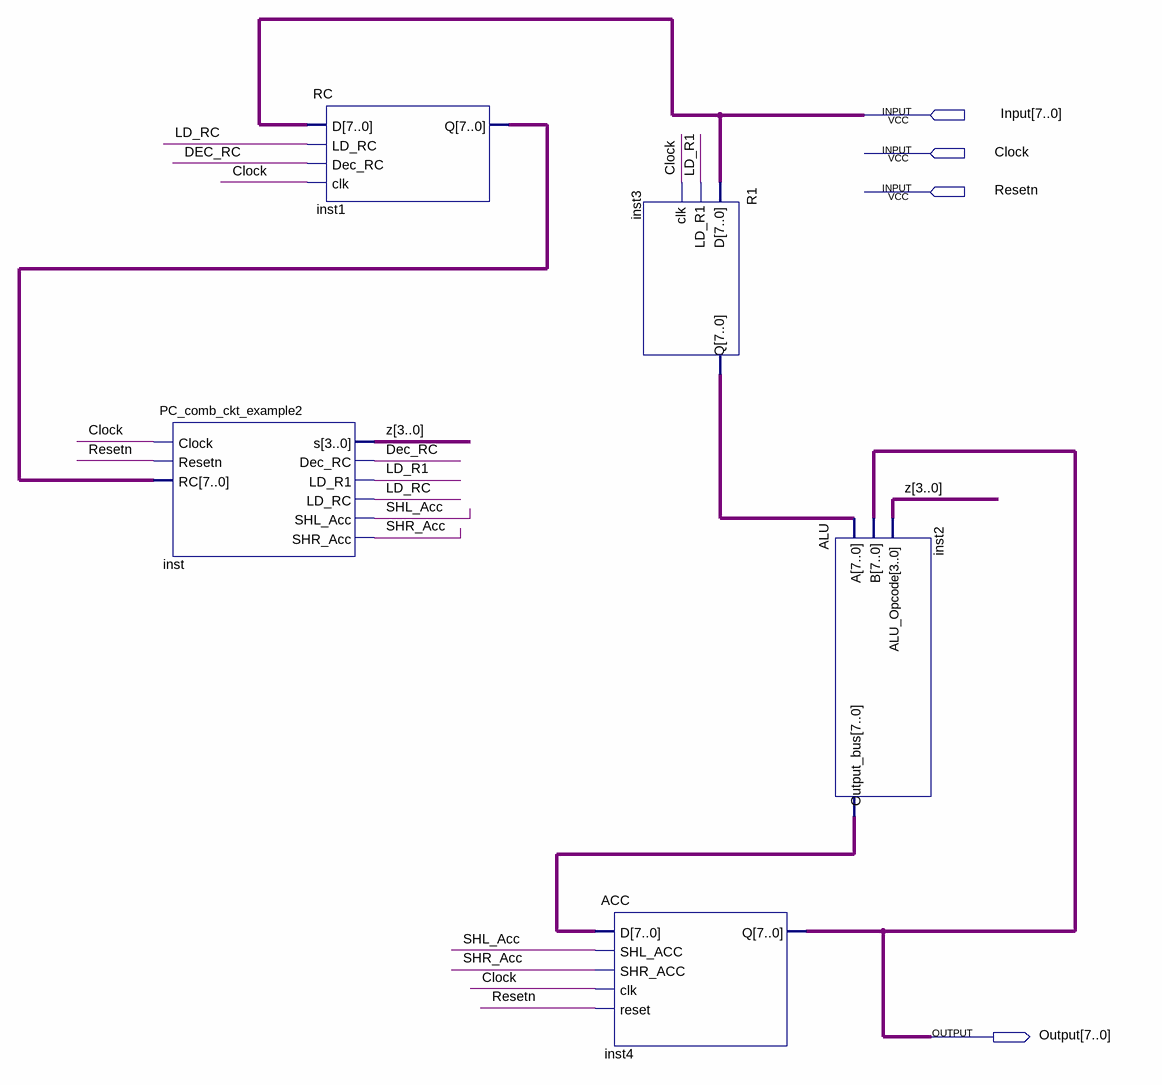
[diagram p0: schematic sheet]
// Quartus schematic lab7_example2.bdf as structural Verilog: 5 symbols, 4 pins
module lab7_example2 (
  input  [7:0] Input,
  input  Clock,
  input  Resetn,
  output [7:0] Output
);

  wire Dec_RC, LD_R1, LD_RC, SHL_Acc, SHR_Acc;
  wire [3:0] z;
  wire [7:0] inst1_q, inst2_output_bus, inst3_q;

  PC_comb_ckt_example2 inst (
    .Clock(Clock), .Resetn(Resetn), .RC(inst1_q), .s(z), .Dec_RC(Dec_RC), .LD_R1(LD_R1), .LD_RC(LD_RC),
    .SHL_Acc(SHL_Acc), .SHR_Acc(SHR_Acc));
  RC inst1 (.D(Input), .LD_RC(LD_RC), .Dec_RC(Dec_RC), .clk(Clock), .Q(inst1_q));
  R1 inst3 (.D(Input), .LD_R1(LD_R1), .clk(Clock), .Q(inst3_q));
  ACC inst4 (.D(inst2_output_bus), .SHL_ACC(SHL_Acc), .SHR_ACC(SHR_Acc), .clk(Clock), .reset(Resetn), .Q(Output));
  ALU inst2 (.A(inst3_q), .B(Output), .ALU_Opcode(z), .Output_bus(inst2_output_bus));
endmodule
